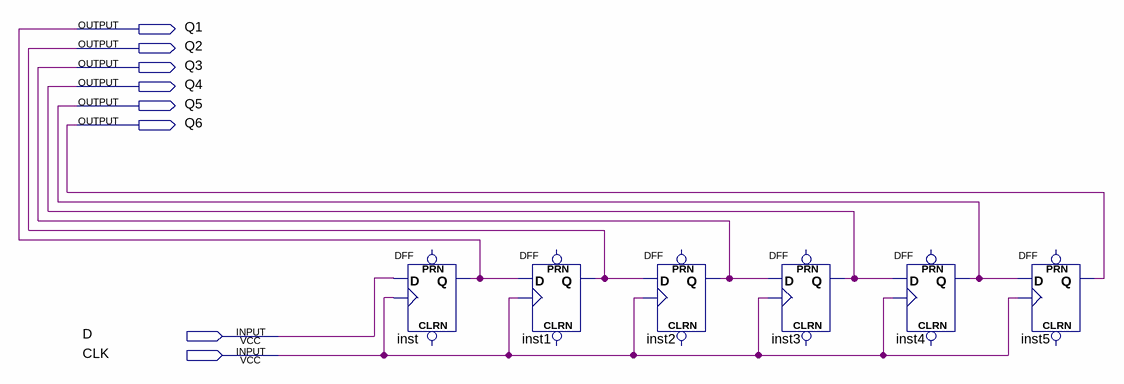
[diagram p0: schematic sheet]
// Quartus schematic LAB1.bdf as structural Verilog: 6 symbols, 8 pins
module LAB1 (
  input  D,
  input  CLK,
  output Q1,
  output Q2,
  output Q3,
  output Q4,
  output Q5,
  output Q6
);

  DFF inst (.CLK(CLK), .D(D), .Q(Q1));  // open: CLRN, PRN
  DFF inst1 (.CLK(CLK), .D(Q1), .Q(Q2));  // open: CLRN, PRN
  DFF inst2 (.CLK(CLK), .D(Q2), .Q(Q3));  // open: CLRN, PRN
  DFF inst3 (.CLK(CLK), .D(Q3), .Q(Q4));  // open: CLRN, PRN
  DFF inst4 (.CLK(CLK), .D(Q4), .Q(Q5));  // open: CLRN, PRN
  DFF inst5 (.CLK(CLK), .D(Q5), .Q(Q6));  // open: CLRN, PRN
endmodule
